# EasyEDA Pro project 平衡小车立创版本.eprj

# Schematic Sheet1
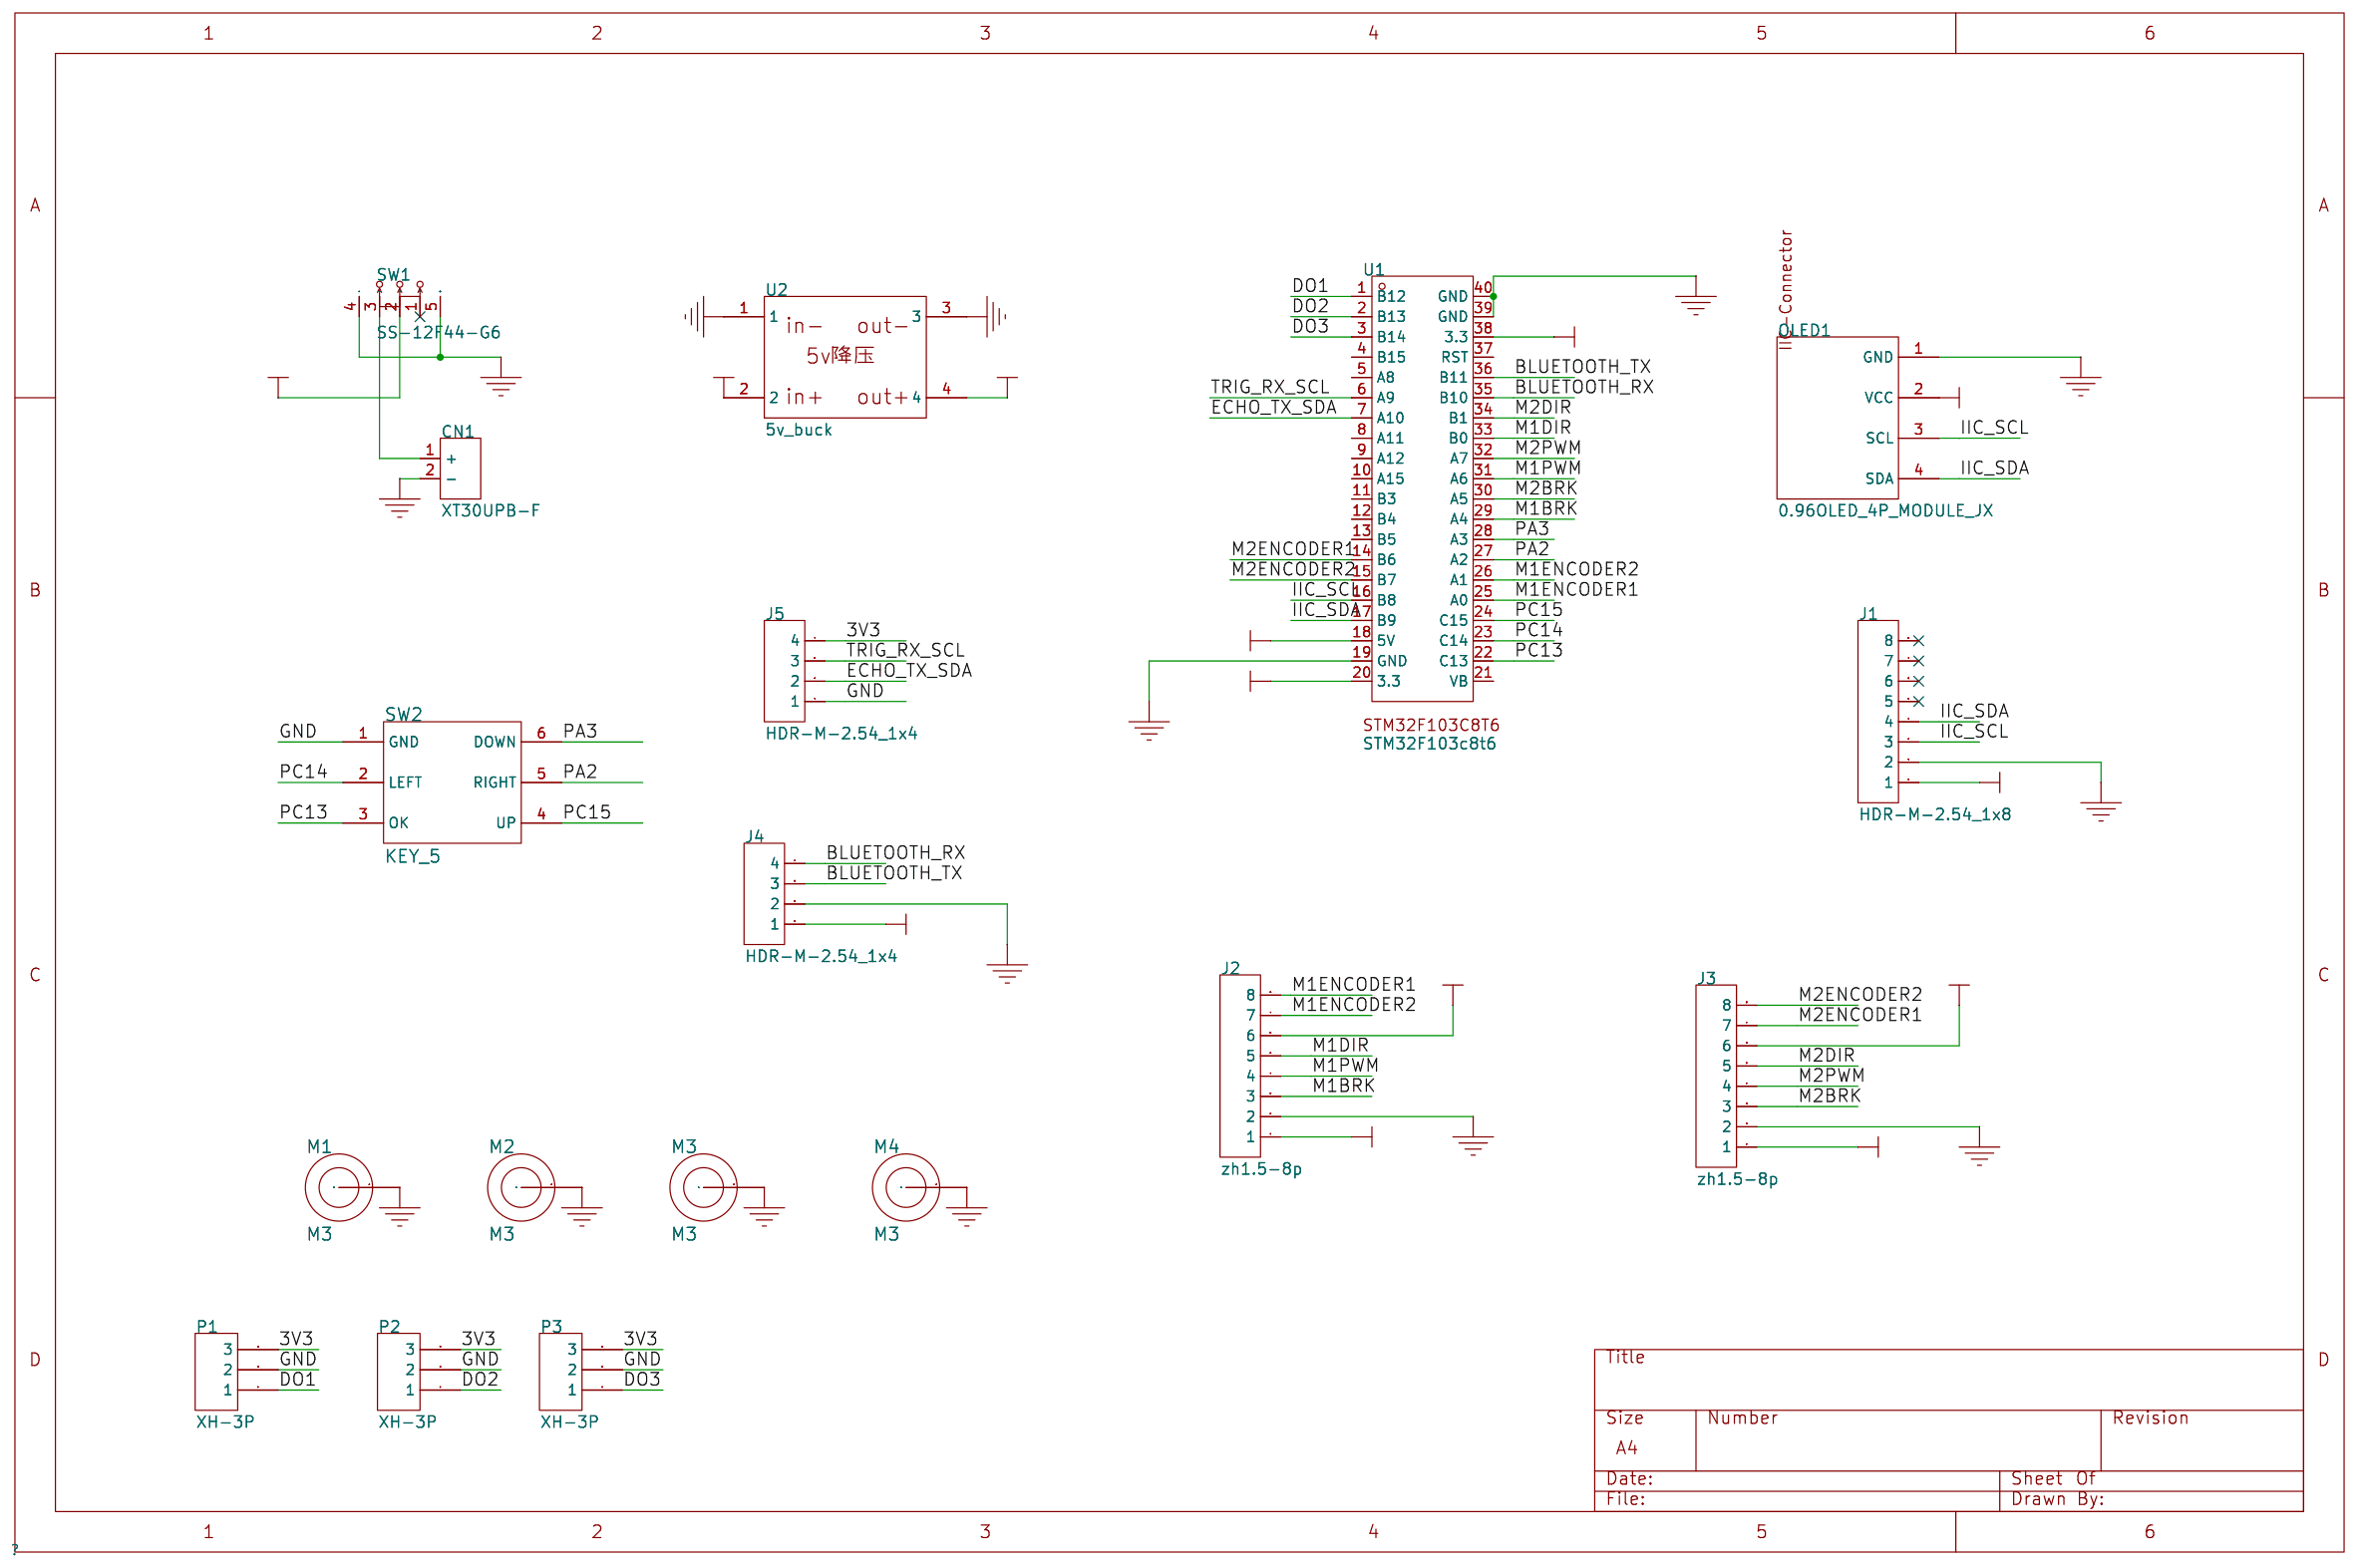
[diagram p0: schematic sheet]

## Parts
CN1  XT30UPB-F  [XT30]
J1  HDR-M-2.54_1x8  [HDR-M-2.54_1X8]
J2  zh1.5-8p  [ZH1.5-8P]
J3  zh1.5-8p  [ZH1.5-8P]
J4  HDR-M-2.54_1x4  [HDR-M-2.54_1X4]
J5  HDR-M-2.54_1x4  [HDR-M-2.54_1X4]
M1  M3  [M3]
M2  M3  [M3]
M3  M3  [M3]
M4  M3  [M3]
OLED1  0.96OLED_4P_MODULE_JX  [0.96OLED_4P]
P1  XH-3P  [XH3pin]
P2  XH-3P  [XH3pin]
P3  XH-3P  [XH3pin]
SW1  SS-12F44-G6  [SW-TH_SS-12F44-GX]
SW2  KEY_5  [KEY_5]
U1  STM32F103c8t6  [stm32f103coreboard]
U2  5v_buck  [5V_BUCK]

## Library data of the parts
CN1 = XT30UPB-F: Library Name: Schlib1
J1 = HDR-M-2.54_1x8: Supplier Part: C190820; Supplier: LCSC; Library Name: Schlib1
J2 J3 = zh1.5-8p: Supplier Part: C190820; Supplier: LCSC; Library Name: Schlib1
J4 J5 = HDR-M-2.54_1x4: Supplier Part: C124378; Supplier: LCSC; Library Name: Schlib1
M1-M4 = M3: Library Name: Schlib1
OLED1 = 0.96OLED_4P_MODULE_JX: Supplier: LCSC; Supplier Part: C9900004566; Manufacturer: null; JLCPCB Part Class: Extended Part; Library Name: Schlib1
P1-P3 = XH-3P: Library Name: Schlib1
SW1 = SS-12F44-G6: Supplier: LCSC; Supplier Part: C698210; Manufacturer: USAKRO; JLCPCB Part Class: Extended Part; Library Name: Schlib1
SW2 = KEY_5: 五向导航按钮; Library Name: Schlib1
U1 = STM32F103c8t6: Library Name: Schlib1
U2 = 5v_buck: Library Name: Schlib1

## Nets
3V3: J1.1 J2.6 J3.6 J5.4 OLED1.2(VCC) P1.3 P2.3 P3.3 U1.20(3.3) U1.38(3.3)
5V: J4.1 U1.18(5V) U2.4
GND: CN1.2(-) J1.2 J2.2 J3.2 J4.2 J5.1 M1.1 M2.1 M3.1 M4.1 OLED1.1(GND) P1.2 P2.2 P3.2 SW1.4 SW1.5 SW2.1(GND) U1.19(GND) U1.39(GND) U1.40(GND) U2.1 U2.3
VBAT: J2.1 J3.1 SW1.2 U2.2
BLUETOOTH_RX: J4.4 U1.35(B10)
BLUETOOTH_TX: J4.3 U1.36(B11)
DO1: P1.1 U1.1(B12)
DO2: P2.1 U1.2(B13)
DO3: P3.1 U1.3(B14)
ECHO_TX_SDA: J5.2 U1.7(A10)
IIC_SCL: J1.3 OLED1.3(SCL) U1.16(B8)
IIC_SDA: J1.4 OLED1.4(SDA) U1.17(B9)
M1BRK: J2.3 U1.29(A4)
M1DIR: J2.5 U1.33(B0)
M1ENCODER1: J2.8 U1.25(A0)
M1ENCODER2: J2.7 U1.26(A1)
M1PWM: J2.4 U1.31(A6)
M2BRK: J3.3 U1.30(A5)
M2DIR: J3.5 U1.34(B1)
M2ENCODER1: J3.7 U1.14(B6)
M2ENCODER2: J3.8 U1.15(B7)
M2PWM: J3.4 U1.32(A7)
PA2: SW2.5(RIGHT) U1.27(A2)
PA3: SW2.6(DOWN) U1.28(A3)
PC13: SW2.3(OK) U1.22(C13)
PC14: SW2.2(LEFT) U1.23(C14)
PC15: SW2.4(UP) U1.24(C15)
TRIG_RX_SCL: J5.3 U1.6(A9)
NETCN1_1: CN1.1(+) SW1.3

Not connected (* = marked no-connect by the designer): J1 5* 6* 7* 8*; SW1 1*; U1 4(B15) 5(A8) 8(A11) 9(A12) 10(A15) 11(B3) 12(B4) 13(B5) 21(VB) 37(RST)

# Board PCB1
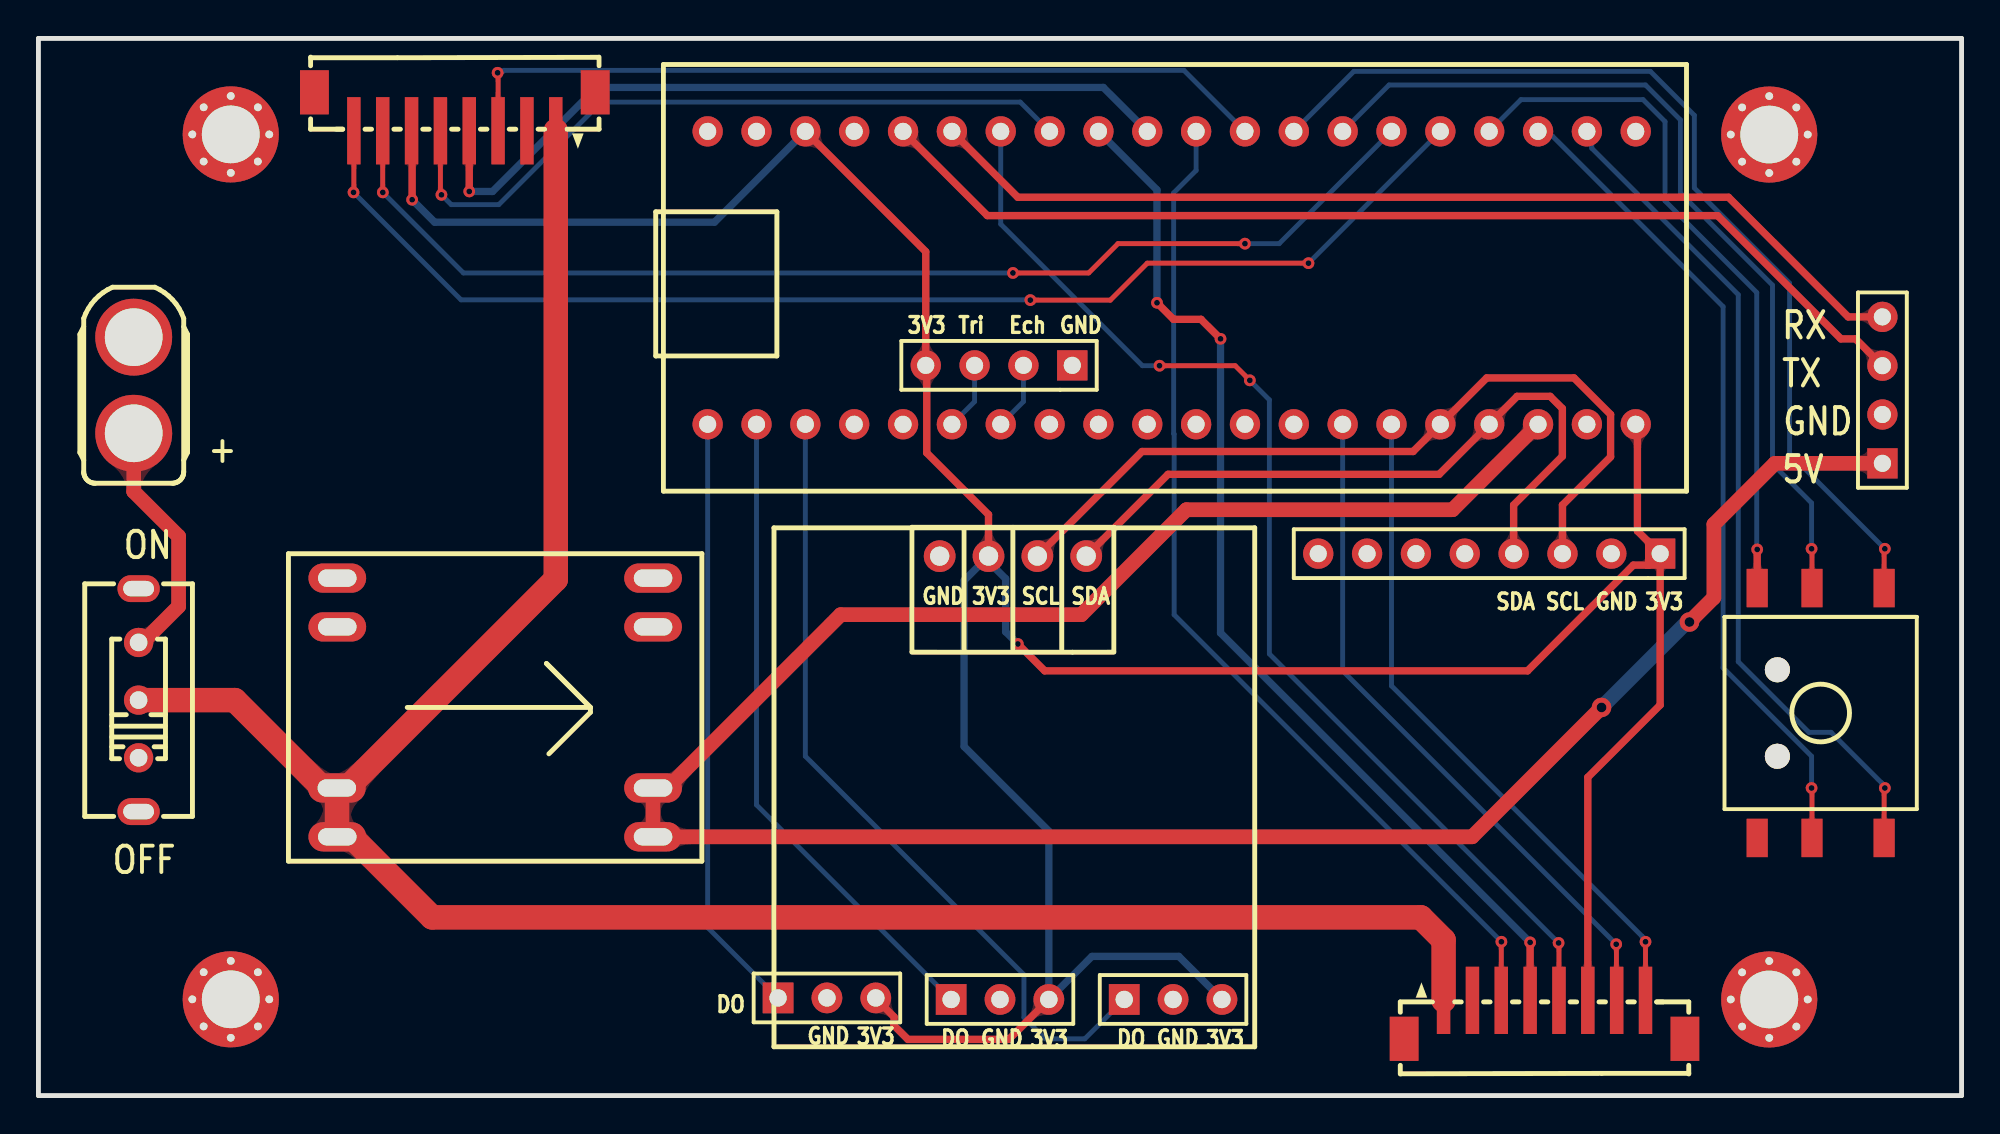
[diagram p1: board, top side]
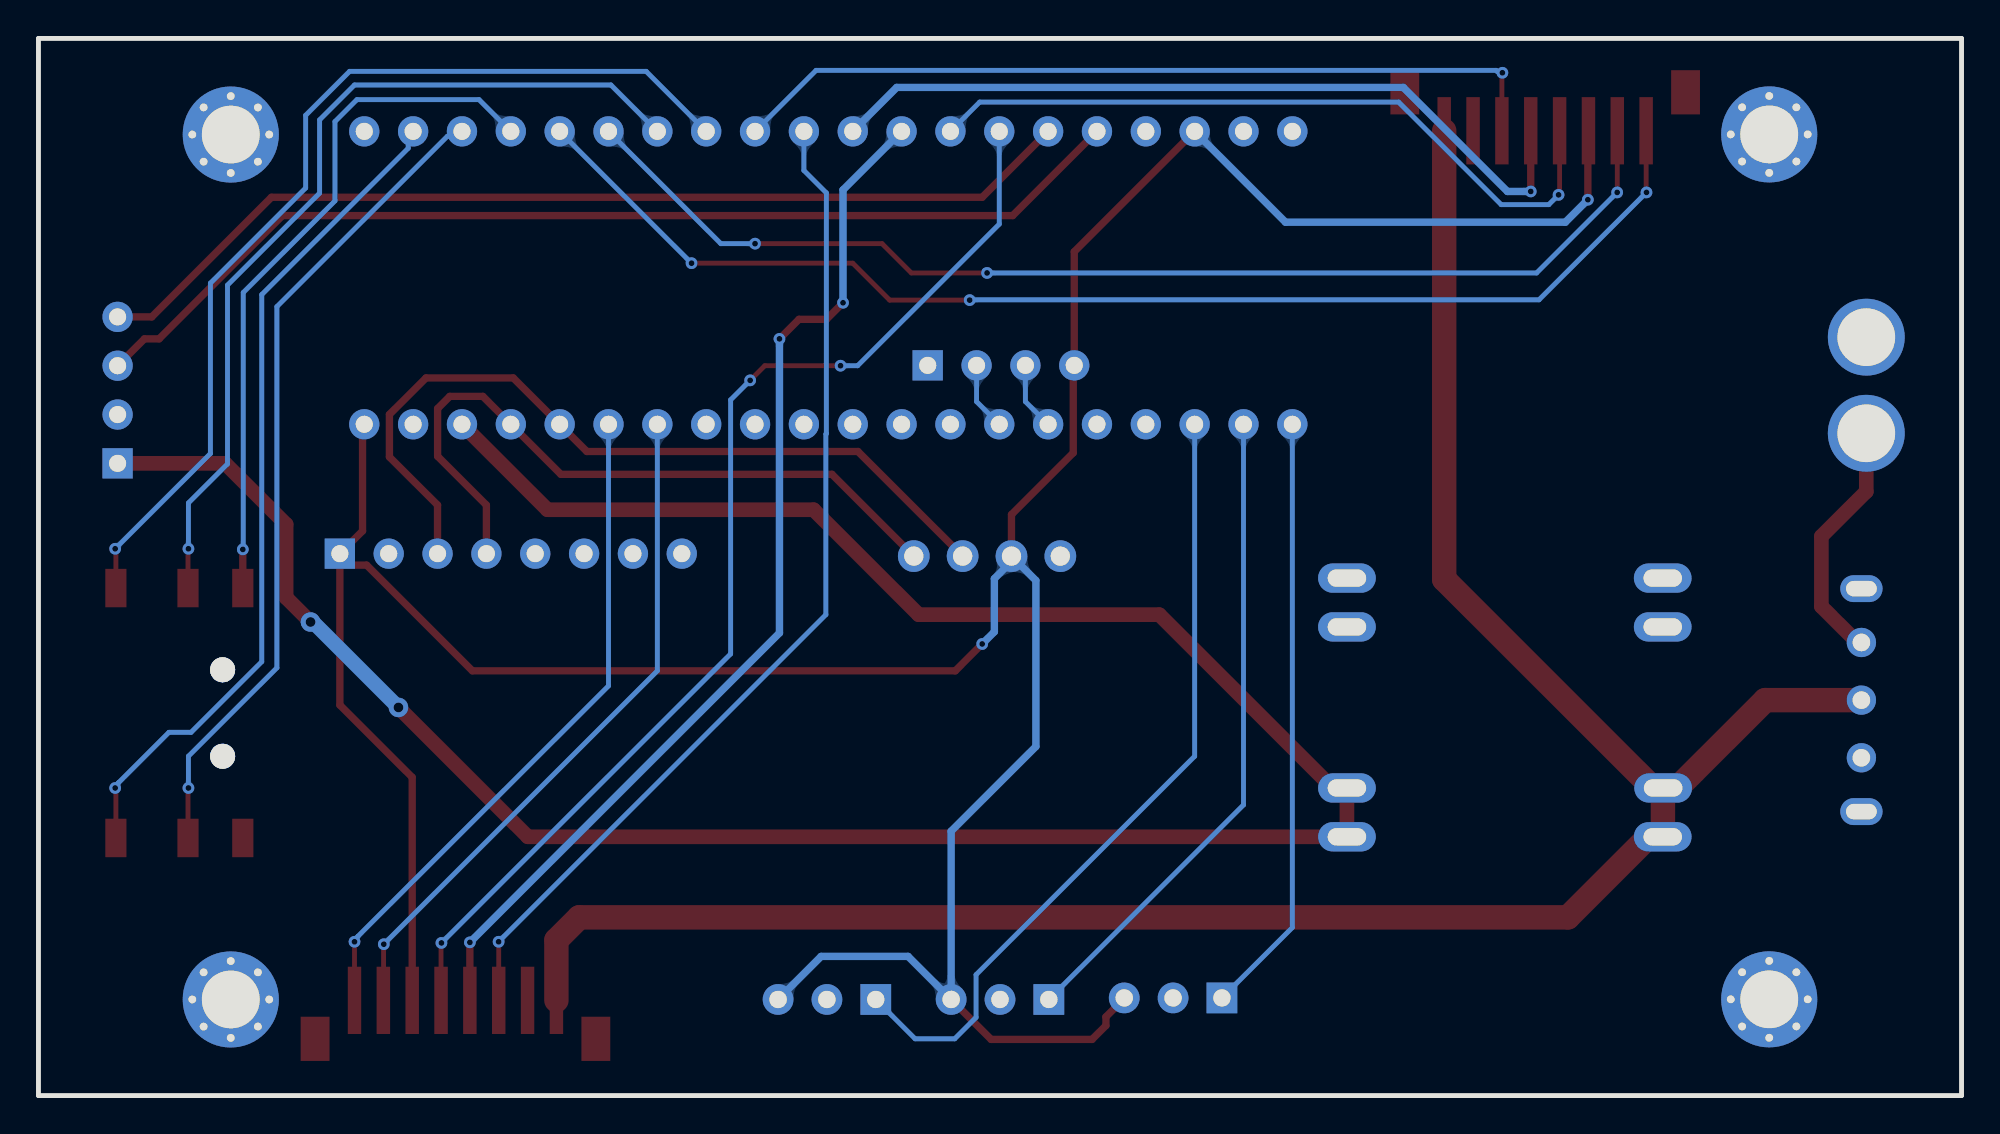
[diagram p2: board, bottom side, seen from below]

Outline 100 x 55 mm; copper layers: Top Layer, Inner1, Inner2, Inner3, Inner4, Inner5, Inner6, Inner7, Inner8, Inner9, Inner10, Inner11, Inner12, Inner13, Inner14, Inner15, Inner16, Inner17, Inner18, Inner19, Inner20, Inner21, Inner22, Inner23, Inner24, Inner25, Inner26, Inner27, Inner28, Inner29, Inner30, Bottom Layer. Coordinates in mm from the lower left corner of the outline.
Outline path: 0,55 0,0 100,0 100,55 0,55
Stack: Top Layer 0.0356mm / Dielectric 1 0.32mm FR-4 er 4.8 / Bottom Layer 0.0356mm

## Design rules (mm)
spacing Clearance (default): track to track 0.254, other pairs 0 to 0.305
track width Width (default): min 0.254, default 0.254, max 1.27
differential pair DiffPairsRouting (default): width min 0.381, default 0.381, max 0.381; gap min 0.254, default 0.254
via RoutingVias (default): diameter min 0.61, default 0.61, max 0.61; hole min 0.305, default 0.305, max 0.305

## Placement (name value [footprint] x y rotation side)
CN1  XT30UPB-F  [XT30]  4.95 36.96 180 top
J1  HDR-M-2.54_1x8  [HDR-M-2.54_1X8]  74.17 28.19 180 top
J2  zh1.5-8p  [ZH1.5-8P]  21.65 51.3 180 top
J3  zh1.5-8p  [ZH1.5-8P]  78.32 3.85 0 top
J4  HDR-M-2.54_1x4  [HDR-M-2.54_1X4]  95.88 36.7 90 top
J5  HDR-M-2.54_1x4  [HDR-M-2.54_1X4]  49.95 37.99 180 top
M1  -  [M3]  10 5 0 top
M2  -  [M3]  90 4.99 0 top
M3  -  [M3]  90 49.99 0 top
M4  -  [M3]  10 50 0 top
NOREF  -  [XH3pin]  59 5 0 top
NOREF#2  -  [XH3pin]  50 5 0 top
NOREF#3  -  [XH3pin]  41 5.08 0 top
OLED1  0.96OLED_4P_MODULE_JX  [0.96OLED_4P]  50.67 28.07 0 top
SW1  SS-12F44-G6  [SW-TH_SS-12F44-GX]  5.21 20.57 90 top
SW2  -  [KEY_5]  89.37 13.4 90 top
U1  STM32F103c8t6  [stm32f103coreboard]  56.18 43.94 0 top
U2  5v_buck  [5V_BUCK]  23.75 20.19 0 top

## Footprints (pads in the part's own frame, mm; a bottom-side part is the same pattern mirrored in y, then rotated)
0.96OLED_4P
  round 1.65 hole 1: 1(-3.81,-0.001) 2(-1.27,0.002) 3(1.27,0.002) 4(3.81,0.002)
5V_BUCK
  oval 3x1.524 hole 2x0.9: 1(-8.21,6.73) 1(-8.21,4.19) 2(-8.232,-4.19) 2(-8.21,-6.73) 3(8.21,6.73) 3(8.21,4.19) 4(8.21,-4.19) 4(8.21,-6.73)
HDR-M-2.54_1X4
  rect 1.575x1.575 hole 0.889: 1(-3.81,0)
  round 1.575 hole 0.889: 2(-1.27,0) 3(1.27,0) 4(3.81,0)
HDR-M-2.54_1X8
  rect 1.575x1.575 hole 0.889: 1(-10.16,0)
  round 1.575 hole 0.889: 2(-7.62,0) 3(-5.08,0) 4(-2.54,0) 5(0,0) 6(2.54,0) 7(5.08,0) 8(7.62,0)
KEY_5
  round 1.3 hole 1.3: 0(4.25,-1.05) 0(8.75,-1.05)
  rect 2x1.1 smd: 1(0,0) 2(0,-2.85) 3(0,-6.6) 4(13,0) 5(13,-2.85) 6(13,-6.6)
M3
  round 0.6 hole 0.405x0.4: 1(-2,0.007) 1(-1.41,1.417) 1(-1.41,-1.403) 1(0,2.007) 1(0,-1.993) 1(1.41,1.417) 1(1.41,-1.403) 1(2,0.007)
  round 5 hole 3.005x3: 1(0,0.007)
stm32f103coreboard
  round 1.575 hole 0.889: 1(-21.379,-9.017) 2(-18.839,-9.017) 3(-16.299,-9.017) 4(-13.759,-9.017) 5(-11.219,-9.017) 6(-8.679,-9.017) 7(-6.139,-9.017) 8(-3.599,-9.017) 9(-1.059,-9.017) 10(1.481,-9.017) 11(4.021,-9.017) 12(6.561,-9.017) 13(9.101,-9.017) 14(11.641,-9.017) 15(14.181,-9.017) 16(16.721,-9.017) 17(19.261,-9.017) 18(21.801,-9.017) 19(24.341,-9.017) 20(26.881,-9.017) 21(26.881,6.223) 22(24.341,6.223) 23(21.801,6.223) 24(19.261,6.223) 25(16.721,6.223) 26(14.181,6.223) 27(11.641,6.223) 28(9.101,6.223) 29(6.561,6.223) 30(4.021,6.223) 31(1.481,6.223) 32(-1.059,6.223) 33(-3.599,6.223) 34(-6.139,6.223) 35(-8.679,6.223) 36(-11.219,6.223) 37(-13.759,6.223) 38(-16.299,6.223) 39(-18.839,6.223) 40(-21.379,6.223)
SW-TH_SS-12F44-GX
  round 1.524 hole 0.914: 1(-3,0) 2(0,0) 3(3,0)
  oval 1.4x2.2 hole 0.8x1.6: 4(5.8,0) 5(-5.8,0)
XH3pin
  rect 1.6x1.6 hole 0.9: 1(-2.54,0)
  round 1.6 hole 0.905x0.9: 2(0,0) 3(2.54,0)
XT30
  round 4 hole 3: 1(0,2.499) 2(0,-2.501)
ZH1.5-8P
  rect 0.7x3.5 smd: 1(-5.25,1.104) 2(-3.75,1.104) 3(-2.25,1.104) 4(-0.75,1.104) 5(0.75,1.104) 6(2.25,1.104) 7(3.75,1.104) 8(5.25,1.104)
  rect 1.5x2.3 smd: 9(7.3,-0.896) 10(-7.3,-0.896)

## Nets
As in the schematic, except:
3V3: J1.1 J2.6 J3.6 J5.4 NOREF.3 NOREF#2.3 NOREF#3.3 OLED1.2 U1.20 U1.38
GND: CN1.2 J1.2 J2.2 J3.2 J4.2 J5.1 M1.1 M2.1 M3.1 M4.1 NOREF.2 NOREF#2.2 NOREF#3.2 OLED1.1 SW1.4 SW1.5 SW2.1 U1.19 U1.39 U1.40 U2.1 U2.3
DO1: NOREF#3.1 U1.1
DO2: NOREF#2.1 U1.2
DO3: NOREF.1 U1.3

Pads without a net: J1 5 6 7 8; J2 9 10; J3 9 10; SW1 1; SW2 0; U1 4 5 8 9 10 11 12 13 21 37

## Via types
v1: diameter 0.61, hole 0.305, Top Layer to Bottom Layer, 25 vias
v2: diameter 1.016, hole 0.508, Top Layer to Bottom Layer, 2 vias

## Routing (per net, layer and track width the routed paths; a pad name or vN(x,y) marks a point on that pad's centre or on a via; arc(x,y) is an arc through that point)
3V3: length 173.8
  Top Layer w0.381: NOREF#2.3 50.46,2.92 45.21,2.92 44.49,3.64 44.49,4.09 43.54,5.05 NOREF#3.3 ; OLED1.2 49.4,30.23 46.19,33.44 46.19,37.94 J5.4 46.14,43.9 U1.38 ; v1(19.43,46.61) 19.43,50.29 19.4,50.26 J2.6 ; v1(50.93,23.5) 52.32,22.1 77.43,22.1 82.93,27.6 83.73,27.6 J1.1 ; J1.1 83.15,29.38 83.15,34.84 U1.20 ; J1.1 84.33,20.32 80.57,16.56 J3.6
  Bottom Layer w0.381: v1(50.93,23.5) 50.29,24.13 50.29,26.89 49.4,27.78 OLED1.2 48.13,26.8 48.13,18.16 52.54,13.75 NOREF#2.3 54.78,7.24 59.3,7.24 NOREF.3 ; v1(19.43,46.61) 20.6,45.44 35.15,45.44 U1.38
5V: length 130.7
  Top Layer w0.762: v2(81.28,20.19) 74.55,13.46 U2.4 U2.4 32.7,16 41.71,25.02 54.23,25.02 59.69,30.48 73.53,30.48 U1.18 ; J4.1 90.3,32.89 87.12,29.72 87.12,25.91 v2(85.85,24.64)
  Bottom Layer w0.762: v2(81.28,20.19) 85.72,24.64 v2(85.85,24.64) 85.98,24.64
VBAT: length 116.9
  Top Layer w1.27: U2.2 15.53,15.99 15.53,13.47 15.54,13.46 16.28,13.46 20.47,9.27 71.88,9.27 73.07,8.09 J3.1 ; U2.2 14.78,16 10.21,20.57 SW1.2 ; U2.2 16.05,16 26.9,26.86 J2.1
BLUETOOTH_RX: length 52.4
  Top Layer w0.381: U1.35 50.93,46.74 87.88,46.74 94.11,40.51 J4.4
BLUETOOTH_TX: length 56
  Top Layer w0.381: U1.36 49.34,45.78 87.31,45.78 93.73,39.37 94.49,39.37 J4.3
DO1: length 31.4
  Bottom Layer w0.254: U1.1 34.8,8.74 NOREF#3.1
DO2: length 34.1
  Bottom Layer w0.254: U1.2 37.34,15.12 NOREF#2.1
DO3: length 42.1
  Bottom Layer w0.254: U1.3 39.88,17.65 51.24,6.29 51.24,4.06 52.36,2.95 54.41,2.95 NOREF.1
ECHO_TX_SDA: length 3.6
  Bottom Layer w0.254: J5.2 51.22,36.11 U1.7
IIC_SCL: length 42.7
  Top Layer w0.381: J1.3 79.25,30.72 81.75,33.23 81.75,35.44 79.85,37.34 75.31,37.34 71.48,33.51 57.38,33.51 OLED1.3
IIC_SDA: length 37.1
  Top Layer w0.381: OLED1.4 58.74,32.32 72.83,32.32 U1.17 76.89,36.38 78.61,36.38 79.24,35.74 79.24,33.26 76.71,30.72 J1.4
M1BRK: length 43.3
  Top Layer w0.254: J2.3 23.9,53.19 v1(23.88,53.21)
  Bottom Layer w0.254: v1(23.88,53.21) 23.94,53.28 24.14,53.28 24.2,53.34 59.56,53.34 U1.29
M1DIR: length 38
  Top Layer w0.254: v1(20.95,46.86) 20.9,46.92 J2.5
  Bottom Layer w0.254: U1.33 51.05,51.69 29.27,51.69 23.94,46.35 21.47,46.35 v1(20.95,46.86)
M1ENCODER1: length 65.7
  Top Layer w0.254: v1(51.58,41.39) 55.74,41.39 57.66,43.31 v1(66.04,43.31) ; J2.8 16.4,47.01 v1(16.38,46.99)
  Bottom Layer w0.254: v1(66.04,43.31) U1.25 ; v1(16.38,46.99) 21.97,41.4 51.56,41.4 v1(51.58,41.39)
M1ENCODER2: length 60.6
  Top Layer w0.254: J2.7 17.9,47 v1(17.91,46.99) ; v1(50.67,42.8) 54.61,42.8 56.13,44.32 v1(62.74,44.32)
  Bottom Layer w0.254: 50.8,42.93 v1(50.67,42.8) 22.1,42.8 v1(17.91,46.99) ; U1.26 64.52,44.32 v1(62.74,44.32)
M1PWM: length 41.7
  Top Layer w0.381: 22.35,46.99 v1(22.4,47.04) J2.4
  Bottom Layer w0.381: v1(22.4,47.04) 23.61,47.04 29.03,52.45 55.37,52.45 U1.31
M2BRK: length 52.8
  Top Layer w0.254: J3.3 76.07,7.99 v1(76.07,8)
  Bottom Layer w0.254: U1.30 60.2,48.13 59.03,46.96 59.03,34.44 59.06,34.42 59.06,25.02 v1(76.07,8)
M2DIR: length 60.1
  Top Layer w0.254: v1(62.99,37.21) 62.23,37.97 v1(58.29,37.97) ; v1(79.05,7.94) 79.07,7.92 J3.5
  Bottom Layer w0.254: v1(58.29,37.97) 57.4,37.97 50.04,45.34 U1.34 ; v1(62.99,37.21) 64.01,36.19 64.01,22.98 v1(79.05,7.94)
M2ENCODER1: length 35.9
  Top Layer w0.254: v1(82.04,7.87) 82.05,7.86 82.05,4.97 J3.7
  Bottom Layer w0.254: v1(82.04,7.87) 67.82,22.1 U1.14
M2ENCODER2: length 35.4
  Top Layer w0.254: J3.8 v1(83.57,8)
  Bottom Layer w0.254: v1(83.57,8) 83.57,8.1 83.39,8.28 83.39,8.28 70.36,21.31 U1.15
M2PWM: length 55.6
  Top Layer w0.381: v1(61.47,39.37) 60.45,40.39 59.02,40.39 v1(58.16,41.25) ; 77.6,8 v1(77.57,7.97) J3.4 ; U1.32 55.37,50.17
  Bottom Layer w0.381: v1(61.47,39.37) 61.47,24.07 v1(77.57,7.97) ; U1.32 58.16,47.12 v1(58.16,41.25)
NETCN1_1: length 12.8
  Top Layer w0.762: CN1.1 4.95,31.43 7.29,29.09 7.29,25.45 5.41,23.57 SW1.3
PA2: length 46.5
  Top Layer w0.254: SW2.5 92.22,28.43 v1(92.2,28.45)
  Bottom Layer w0.254: v1(92.2,28.45) 92.2,30.83 90.17,32.86 90.17,42.16 85.38,46.95 85.38,50.76 83.57,52.58 70.23,52.58 U1.27
PA3: length 51.8
  Top Layer w0.254: v1(96.01,28.45) 95.97,28.41 SW2.6
  Bottom Layer w0.254: U1.28 68.4,53.29 83.82,53.29 86.11,51 86.11,47.22 91.06,42.27 91.06,33.4 v1(96.01,28.45)
PC13: length 43.9
  Top Layer w0.254: SW2.3 95.97,15.96 v1(96.01,16)
  Bottom Layer w0.254: U1.22 80.77,49.91 80.77,49.29 88.39,41.67 88.39,22.57 92.06,18.9 93.22,18.9 95.83,16.28 95.83,16.28 96.01,16.1 v1(96.01,16)
PC14: length 43
  Top Layer w0.254: SW2.2 92.22,15.98 v1(92.2,16)
  Bottom Layer w0.254: v1(92.2,16) 92.2,17.65 87.6,22.25 87.6,41.05 78.73,49.91 78.23,49.91 U1.23
PC15: length 36.6
  Top Layer w0.381: SW2.4 v1(89.37,28.41) 89.41,28.45
  Bottom Layer w0.254: v1(89.37,28.41) 89.35,28.44 89.35,41.78 84.58,46.55 84.58,50.67 83.44,51.82 77.09,51.82 U1.24
TRIG_RX_SCL: length 3.6
  Bottom Layer w0.254: J5.3 48.68,36.11 U1.6

## Copper pours and planes (outline as drawn; the poured copper is in the pictures)
GND on Top Layer: 0,55.25 100.2,55.25 100.33,55.12 100.33,0.25 0.25,0.25 0,0.51
GND on Bottom Layer: 0.13,55.12 100.08,55.12 100.08,0.13 99.95,0.25 0.13,0.25

Small or netless copper shapes (teardrops, artwork), in the pictures only: 77 on Top Layer, 52 on Bottom Layer

## Text on the board
Top Silkscreen Layer: DO | GND | 3V3 | Tri | Ech | SCL | SDA | + | OFF | ON | RX | TX | 5V
